# EasyEDA Pro project Charger Splitter.eprj, board PCB3
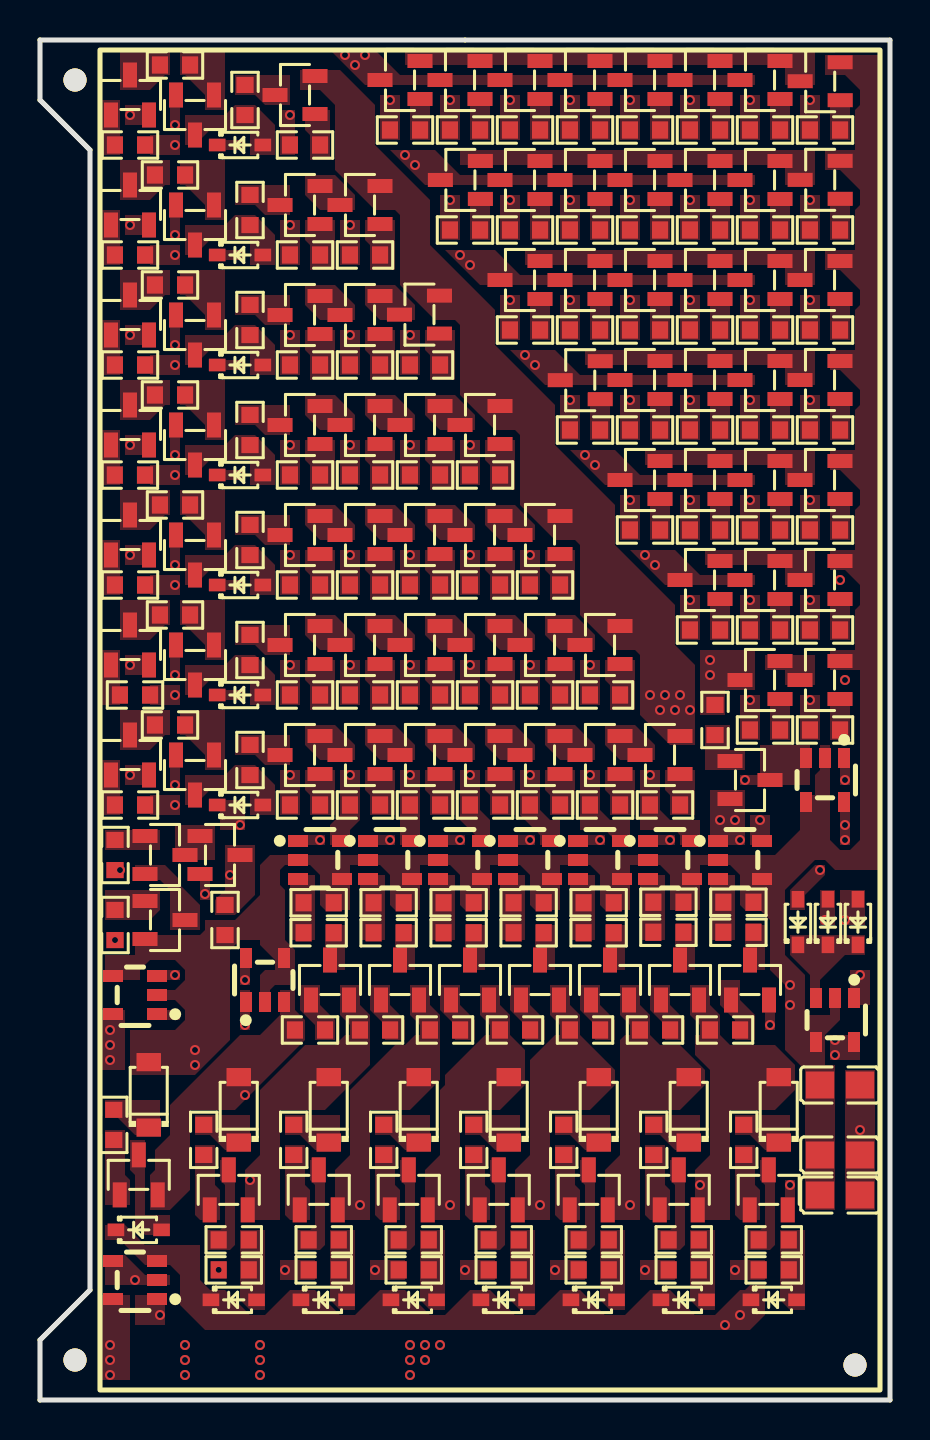
[diagram p9: board, top side]
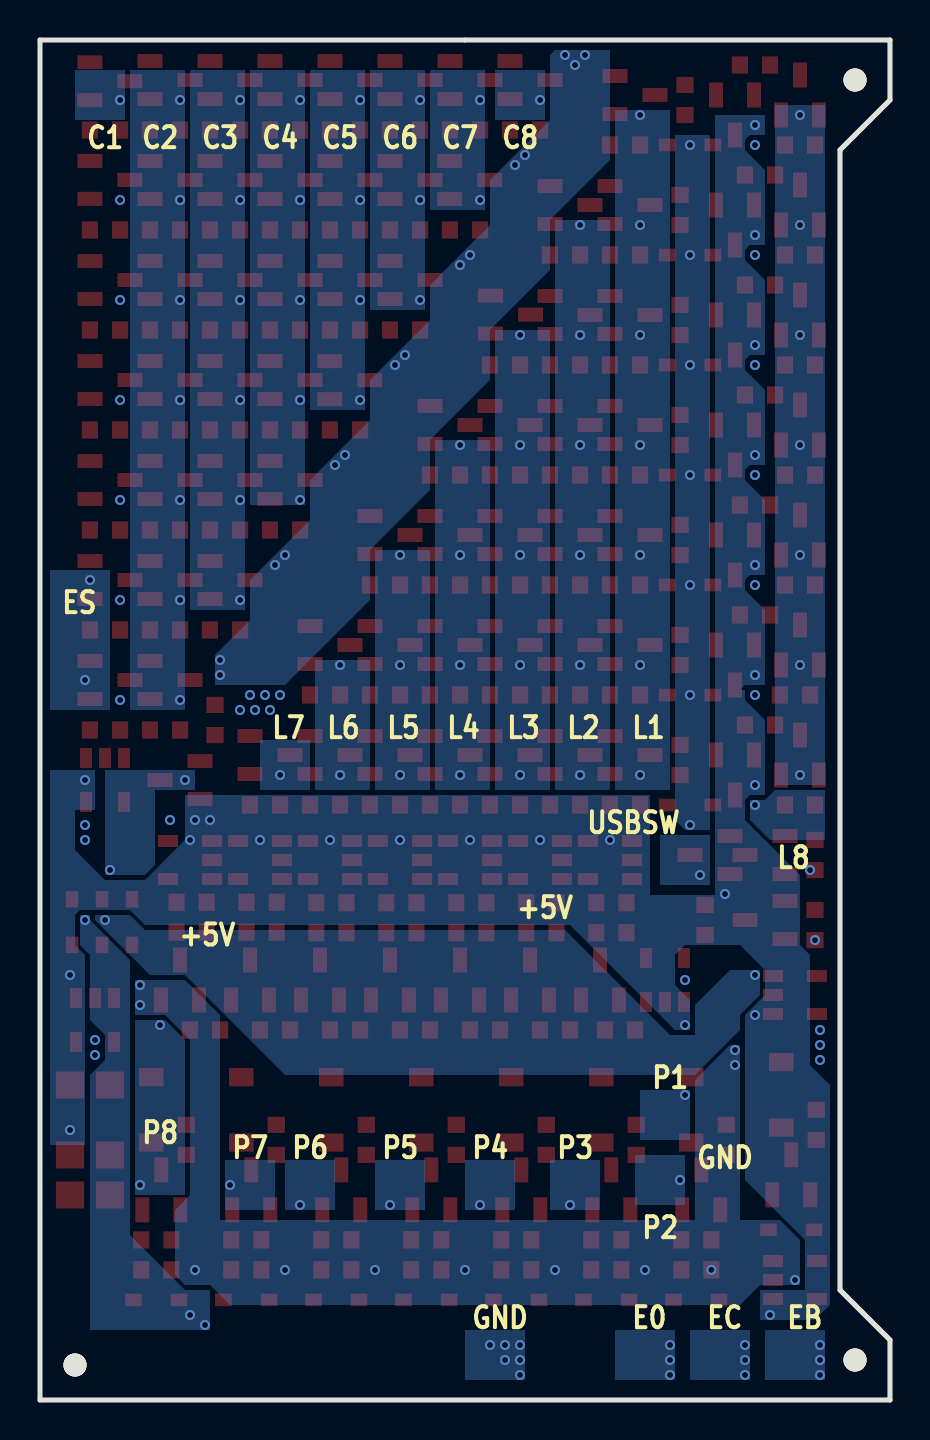
[diagram p10: board, bottom side, seen from below]

Outline 42.5 x 68 mm; copper layers: Top Layer, Inner1, Inner2, Bottom Layer. Coordinates in mm from the lower left corner of the outline.
Outline path: 0,68 42.5,68 42.5,0 0,0 0,3 2.5,5.5 2.5,62.5 0,65 0,68
Stack: Top Layer 0.035mm Outer layer thickness 1oz / Dielectric1 0.2104mm 7628 RC49% 8.6mil / Inner1 0.0152mm Inner layer thickness / Dielectric2 1.065mm 1.1mm H/HOZ Copper / Inner2 0.0152mm Inner layer thickness / Dielectric3 0.2104mm 7628 RC49% 8.6mil / Bottom Layer 0.035mm Outer layer thickness 1oz

## Design rules (mm)
template: JLCPCB Capability(Two Layers Board)
spacing copperThickness1oz (default): track to track 0.102, other pairs 0.152 to 0.3
spacing copperThickness2oz: track to track 0.203, other pairs 0.152 to 0.3
track width copperThickness1oz (default): min 0.127, default 0.254, max 2.54
track width copperThickness2oz: min 0.203, default 0.254, max 2.54
differential pair differentialPair (default): width min 0.127, default 0.254, max 2.54; gap min 0.152, default 0.152
via viaSize (default): diameter min 0.5, default 0.61, max 10; hole min 0.3, default 0.305, max 6.3

## Placement (name value [footprint] x y rotation side)
C1  47uF  [C0805]  40 12.25 180 top
C2  47uF  [C0805]  40 15.75 180 top
C3  47uF  [C0805]  40 10.25 180 top
D22  MM1Z3V3  [SOD-123_L2.7-W1.6-LS3.7-RD]  5.44 15.26 90 top
D23  SD103AWS  [SOD-323_L1.7-W1.3-LS2.6-RD-1]  4.94 8.51 0 top
D24  SD103AWS  [SOD-323_L1.7-W1.3-LS2.6-RD-1]  10 51.75 0 top
D25  SD103AWS  [SOD-323_L1.7-W1.3-LS2.6-RD-1]  10 46.25 0 top
D26  SD103AWS  [SOD-323_L1.7-W1.3-LS2.6-RD-1]  10 57.25 0 top
D27  SD103AWS  [SOD-323_L1.7-W1.3-LS2.6-RD-1]  10 40.75 0 top
D28  SD103AWS  [SOD-323_L1.7-W1.3-LS2.6-RD-1]  10 62.75 0 top
D29  SD103AWS  [SOD-323_L1.7-W1.3-LS2.6-RD-1]  10 35.25 0 top
D30  SD103AWS  [SOD-323_L1.7-W1.3-LS2.6-RD-1]  10 29.75 0 top
D36  MM1Z3V3  [SOD-123_L2.7-W1.6-LS3.7-RD]  9.94 14.51 90 top
D37  SD103AWS  [SOD-323_L1.7-W1.3-LS2.6-RD-1]  9.69 5.01 0 top
D38  MM1Z3V3  [SOD-123_L2.7-W1.6-LS3.7-RD]  14.44 14.51 90 top
D39  SD103AWS  [SOD-323_L1.7-W1.3-LS2.6-RD-1]  14.19 5.01 0 top
D40  MM1Z3V3  [SOD-123_L2.7-W1.6-LS3.7-RD]  18.94 14.51 90 top
D41  SD103AWS  [SOD-323_L1.7-W1.3-LS2.6-RD-1]  18.69 5.01 0 top
D42  MM1Z3V3  [SOD-123_L2.7-W1.6-LS3.7-RD]  23.44 14.51 90 top
D43  SD103AWS  [SOD-323_L1.7-W1.3-LS2.6-RD-1]  23.19 5.01 0 top
D44  MM1Z3V3  [SOD-123_L2.7-W1.6-LS3.7-RD]  27.94 14.51 90 top
D45  SD103AWS  [SOD-323_L1.7-W1.3-LS2.6-RD-1]  27.69 5.01 0 top
D46  MM1Z3V3  [SOD-123_L2.7-W1.6-LS3.7-RD]  32.44 14.51 90 top
D47  SD103AWS  [SOD-323_L1.7-W1.3-LS2.6-RD-1]  32.19 5.01 0 top
D48  MM1Z3V3  [SOD-123_L2.7-W1.6-LS3.7-RD]  36.94 14.51 90 top
D49  SD103AWS  [SOD-323_L1.7-W1.3-LS2.6-RD-1]  36.69 5.01 0 top
D50  SD103AWS  [SOD-323_L1.7-W1.3-LS2.6-RD-1]  37.9 23.9 90 top
D51  SD103AWS  [SOD-323_L1.7-W1.3-LS2.6-RD-1]  39.4 23.9 90 top
D52  SD103AWS  [SOD-323_L1.7-W1.3-LS2.6-RD-1]  40.9 23.9 90 top
NOREF  -  [Pad_e593]  1.75 66 0 top
NOREF#2  -  [Pad_e108]  40.75 1.75 0 top
NOREF#3  -  [Pad_e469]  1.75 2 0 top
Q164  MMBT4401  [SOT-23-3_L2.9-W1.3-P1.90-LS2.4-BR]  36 36 0 top
Q165  MMBT4401  [SOT-23-3_L2.9-W1.3-P1.90-LS2.4-BR]  39 36 0 top
Q166  MMBT4401  [SOT-23-3_L2.9-W1.3-P1.90-LS2.4-BR]  39 41 0 top
Q167  MMBT4401  [SOT-23-3_L2.9-W1.3-P1.90-LS2.4-BR]  33 41 0 top
Q168  MMBT4401  [SOT-23-3_L2.9-W1.3-P1.90-LS2.4-BR]  36 41 0 top
Q169  MMBT4401  [SOT-23-3_L2.9-W1.3-P1.90-LS2.4-BR]  36 46 0 top
Q170  MMBT4401  [SOT-23-3_L2.9-W1.3-P1.90-LS2.4-BR]  33 46 0 top
Q171  MMBT4401  [SOT-23-3_L2.9-W1.3-P1.90-LS2.4-BR]  30 46 0 top
Q172  MMBT4401  [SOT-23-3_L2.9-W1.3-P1.90-LS2.4-BR]  39 46 0 top
Q173  MMBT4401  [SOT-23-3_L2.9-W1.3-P1.90-LS2.4-BR]  39 51 0 top
Q174  MMBT4401  [SOT-23-3_L2.9-W1.3-P1.90-LS2.4-BR]  27.01 50.99 0 top
Q175  MMBT4401  [SOT-23-3_L2.9-W1.3-P1.90-LS2.4-BR]  30 51 0 top
Q176  MMBT4401  [SOT-23-3_L2.9-W1.3-P1.90-LS2.4-BR]  33 51 0 top
Q177  MMBT4401  [SOT-23-3_L2.9-W1.3-P1.90-LS2.4-BR]  36 51 0 top
Q178  MMBT4401  [SOT-23-3_L2.9-W1.3-P1.90-LS2.4-BR]  39 56 0 top
Q179  MMBT4401  [SOT-23-3_L2.9-W1.3-P1.90-LS2.4-BR]  24 56 0 top
Q180  MMBT4401  [SOT-23-3_L2.9-W1.3-P1.90-LS2.4-BR]  27 56 0 top
Q181  MMBT4401  [SOT-23-3_L2.9-W1.3-P1.90-LS2.4-BR]  30 56 0 top
Q182  MMBT4401  [SOT-23-3_L2.9-W1.3-P1.90-LS2.4-BR]  33 56 0 top
Q183  MMBT4401  [SOT-23-3_L2.9-W1.3-P1.90-LS2.4-BR]  36 56 0 top
Q184  MMBT4401  [SOT-23-3_L2.9-W1.3-P1.90-LS2.4-BR]  39.01 61.01 0 top
Q185  MMBT4401  [SOT-23-3_L2.9-W1.3-P1.90-LS2.4-BR]  36 61 0 top
Q186  MMBT4401  [SOT-23-3_L2.9-W1.3-P1.90-LS2.4-BR]  33 61 0 top
Q187  MMBT4401  [SOT-23-3_L2.9-W1.3-P1.90-LS2.4-BR]  30 61 0 top
Q188  MMBT4401  [SOT-23-3_L2.9-W1.3-P1.90-LS2.4-BR]  27 61 0 top
Q189  MMBT4401  [SOT-23-3_L2.9-W1.3-P1.90-LS2.4-BR]  24 61 0 top
Q190  MMBT4401  [SOT-23-3_L2.9-W1.3-P1.90-LS2.4-BR]  21.02 61 0 top
Q191  MMBT4401  [SOT-23-3_L2.9-W1.3-P1.90-LS2.4-BR]  39.01 65.94 0 top
Q192  MMBT4401  [SOT-23-3_L2.9-W1.3-P1.90-LS2.4-BR]  18 66 0 top
Q193  MMBT4401  [SOT-23-3_L2.9-W1.3-P1.90-LS2.4-BR]  21 66 0 top
Q194  MMBT4401  [SOT-23-3_L2.9-W1.3-P1.90-LS2.4-BR]  24 66 0 top
Q195  MMBT4401  [SOT-23-3_L2.9-W1.3-P1.90-LS2.4-BR]  27 66 0 top
Q196  MMBT4401  [SOT-23-3_L2.9-W1.3-P1.90-LS2.4-BR]  30 66 0 top
Q197  MMBT4401  [SOT-23-3_L2.9-W1.3-P1.90-LS2.4-BR]  33 66 0 top
Q198  MMBT4401  [SOT-23-3_L2.9-W1.3-P1.90-LS2.4-BR]  36 66 0 top
Q199  MMBT4401  [SOT-23-3_L2.9-W1.3-P1.90-LS2.4-BR]  6.25 27.25 180 top
Q200  MMBT4401  [SOT-23-3_L2.9-W1.3-P1.90-LS2.4-BR]  6.25 24 180 top
Q201  MMBT4401  [SOT-23-3_L2.9-W1.3-P1.90-LS2.4-BR]  22 48.75 0 top
Q202  MMBT4401  [SOT-23-3_L2.9-W1.3-P1.90-LS2.4-BR]  19 48.75 0 top
Q203  MMBT4401  [SOT-23-3_L2.9-W1.3-P1.90-LS2.4-BR]  16 48.75 0 top
Q204  MMBT4401  [SOT-23-3_L2.9-W1.3-P1.90-LS2.4-BR]  13 48.75 0 top
Q205  MMBT4401  [SOT-23-3_L2.9-W1.3-P1.90-LS2.4-BR]  4.5 48.75 270 top
Q206  MMBT4401  [SOT-23-3_L2.9-W1.3-P1.90-LS2.4-BR]  25 43.25 0 top
Q207  MMBT4401  [SOT-23-3_L2.9-W1.3-P1.90-LS2.4-BR]  22 43.25 0 top
Q208  MMBT4401  [SOT-23-3_L2.9-W1.3-P1.90-LS2.4-BR]  19 43.25 0 top
Q209  MMBT4401  [SOT-23-3_L2.9-W1.3-P1.90-LS2.4-BR]  16 43.25 0 top
Q210  MMBT4401  [SOT-23-3_L2.9-W1.3-P1.90-LS2.4-BR]  13 43.25 0 top
Q211  MMBT4401  [SOT-23-3_L2.9-W1.3-P1.90-LS2.4-BR]  4.5 43.25 270 top
Q212  MMBT4401  [SOT-23-3_L2.9-W1.3-P1.90-LS2.4-BR]  16 37.75 0 top
Q213  MMBT4401  [SOT-23-3_L2.9-W1.3-P1.90-LS2.4-BR]  13 37.75 0 top
Q214  MMBT4401  [SOT-23-3_L2.9-W1.3-P1.90-LS2.4-BR]  19 37.75 0 top
Q215  MMBT4401  [SOT-23-3_L2.9-W1.3-P1.90-LS2.4-BR]  22 37.75 0 top
Q216  MMBT4401  [SOT-23-3_L2.9-W1.3-P1.90-LS2.4-BR]  25 37.75 0 top
Q217  MMBT4401  [SOT-23-3_L2.9-W1.3-P1.90-LS2.4-BR]  4.5 37.75 270 top
Q218  MMBT4401  [SOT-23-3_L2.9-W1.3-P1.90-LS2.4-BR]  28 37.75 0 top
Q219  MMBT4401  [SOT-23-3_L2.9-W1.3-P1.90-LS2.4-BR]  18.97 54.27 0 top
Q220  MMBT4401  [SOT-23-3_L2.9-W1.3-P1.90-LS2.4-BR]  16 54.25 0 top
Q221  MMBT4401  [SOT-23-3_L2.9-W1.3-P1.90-LS2.4-BR]  13 54.25 0 top
Q222  MMBT4401  [SOT-23-3_L2.9-W1.3-P1.90-LS2.4-BR]  4.5 54.25 270 top
Q223  MMBT4401  [SOT-23-3_L2.9-W1.3-P1.90-LS2.4-BR]  13 59.75 0 top
Q224  MMBT4401  [SOT-23-3_L2.9-W1.3-P1.90-LS2.4-BR]  16 59.75 0 top
Q225  MMBT4401  [SOT-23-3_L2.9-W1.3-P1.90-LS2.4-BR]  4.5 59.75 270 top
Q226  MMBT4401  [SOT-23-3_L2.9-W1.3-P1.90-LS2.4-BR]  4.5 65.25 270 top
Q227  MMBT4401  [SOT-23-3_L2.9-W1.3-P1.90-LS2.4-BR]  12.75 65.25 0 top
Q228  MMBT4401  [SOT-23-3_L2.9-W1.3-P1.90-LS2.4-BR]  4.5 32.25 270 top
Q229  MMBT4401  [SOT-23-3_L2.9-W1.3-P1.90-LS2.4-BR]  13 32.25 0 top
Q230  MMBT4401  [SOT-23-3_L2.9-W1.3-P1.90-LS2.4-BR]  16 32.25 0 top
Q231  MMBT4401  [SOT-23-3_L2.9-W1.3-P1.90-LS2.4-BR]  19 32.25 0 top
Q232  MMBT4401  [SOT-23-3_L2.9-W1.3-P1.90-LS2.4-BR]  22 32.25 0 top
Q233  MMBT4401  [SOT-23-3_L2.9-W1.3-P1.90-LS2.4-BR]  25 32.25 0 top
Q234  MMBT4401  [SOT-23-3_L2.9-W1.3-P1.90-LS2.4-BR]  28 32.25 0 top
Q235  MMBT4401  [SOT-23-3_L2.9-W1.3-P1.90-LS2.4-BR]  31 32.25 0 top
Q237  MMBT4403  [SOT-23-3_L2.9-W1.3-P0.95-LS2.4-BR]  7.75 53.25 90 top
Q238  MMBT4403  [SOT-23-3_L2.9-W1.3-P0.95-LS2.4-BR]  7.75 58.75 90 top
Q239  MMBT4403  [SOT-23-3_L2.9-W1.3-P0.95-LS2.4-BR]  7.75 64.25 90 top
Q240  MMBT4403  [SOT-23-3_L2.9-W1.3-P0.95-LS2.4-BR]  7.75 36.75 90 top
Q241  MMBT4403  [SOT-23-3_L2.9-W1.3-P0.95-LS2.4-BR]  7.75 42.25 90 top
Q242  MMBT4403  [SOT-23-3_L2.9-W1.3-P0.95-LS2.4-BR]  7.75 47.75 90 top
Q243  MMBT4403  [SOT-23-3_L2.9-W1.3-P0.95-LS2.4-BR]  7.75 31.25 90 top
Q244  MMBT4403  [SOT-23-3_L2.9-W1.3-P0.95-LS2.4-BR]  4.94 11.26 270 top
Q245  MMBT4403  [SOT-23-3_L2.9-W1.3-P0.95-LS2.4-BR]  9.44 10.51 270 top
Q246  MMBT4403  [SOT-23-3_L2.9-W1.3-P0.95-LS2.4-BR]  13.94 10.51 270 top
Q247  MMBT4403  [SOT-23-3_L2.9-W1.3-P0.95-LS2.4-BR]  18.44 10.51 270 top
Q248  MMBT4403  [SOT-23-3_L2.9-W1.3-P0.95-LS2.4-BR]  22.94 10.51 270 top
Q249  MMBT4403  [SOT-23-3_L2.9-W1.3-P0.95-LS2.4-BR]  27.44 10.51 270 top
Q250  MMBT4403  [SOT-23-3_L2.9-W1.3-P0.95-LS2.4-BR]  31.94 10.51 270 top
Q251  MMBT4403  [SOT-23-3_L2.9-W1.3-P0.95-LS2.4-BR]  36.44 10.51 270 top
Q252  MMBT4403  [SOT-23-3_L2.9-W1.3-P0.95-LS2.4-BR]  14.5 21 270 top
Q253  MMBT4403  [SOT-23-3_L2.9-W1.3-P0.95-LS2.4-BR]  18 21 270 top
Q254  MMBT4403  [SOT-23-3_L2.9-W1.3-P0.95-LS2.4-BR]  21.5 21 270 top
Q255  MMBT4403  [SOT-23-3_L2.9-W1.3-P0.95-LS2.4-BR]  25 21 270 top
Q256  MMBT4403  [SOT-23-3_L2.9-W1.3-P0.95-LS2.4-BR]  28.5 21 270 top
Q257  MMBT4403  [SOT-23-3_L2.9-W1.3-P0.95-LS2.4-BR]  32 21 270 top
Q258  MMBT4403  [SOT-23-3_L2.9-W1.3-P0.95-LS2.4-BR]  35.5 21 270 top
Q259  MMBT4403  [SOT-23-3_L2.9-W1.3-P0.95-LS2.4-BR]  35.5 31 180 top
Q260  MMBT4403  [SOT-23-3_L2.9-W1.3-P0.95-LS2.4-BR]  9 27.25 180 top
R81  22kΩ  [R0603]  4.5 62.75 0 top
R82  22kΩ  [R0603]  6.75 66.75 0 top
R83  22kΩ  [R0603]  10.25 65 270 top
R87  22kΩ  [R0603]  13.25 62.75 180 top
R88  22kΩ  [R0603]  4.5 57.25 0 top
R89  22kΩ  [R0603]  6.5 61.25 0 top
R90  22kΩ  [R0603]  10.5 59.5 270 top
R91  22kΩ  [R0603]  13.25 57.25 180 top
R92  22kΩ  [R0603]  16.25 57.25 180 top
R93  22kΩ  [R0603]  4.5 51.75 0 top
R94  22kΩ  [R0603]  6.5 55.75 0 top
R95  22kΩ  [R0603]  10.5 54 270 top
R96  22kΩ  [R0603]  13.25 51.75 180 top
R97  22kΩ  [R0603]  16.25 51.75 180 top
R98  22kΩ  [R0603]  19.25 51.75 180 top
R99  22kΩ  [R0603]  4.5 46.25 0 top
R100  22kΩ  [R0603]  6.5 50.25 0 top
R101  22kΩ  [R0603]  10.5 48.5 270 top
R102  22kΩ  [R0603]  13.25 46.25 180 top
R103  22kΩ  [R0603]  16.25 46.25 180 top
R104  22kΩ  [R0603]  19.25 46.25 180 top
R105  22kΩ  [R0603]  22.25 46.25 180 top
R106  22kΩ  [R0603]  4.5 40.75 0 top
R107  22kΩ  [R0603]  6.75 44.75 0 top
R108  22kΩ  [R0603]  10.5 43 270 top
R109  22kΩ  [R0603]  13.25 40.75 180 top
R110  22kΩ  [R0603]  16.25 40.75 180 top
R111  22kΩ  [R0603]  19.25 40.75 180 top
R112  22kΩ  [R0603]  22.25 40.75 180 top
R113  22kΩ  [R0603]  25.25 40.75 180 top
R114  22kΩ  [R0603]  4.75 35.25 0 top
R115  22kΩ  [R0603]  6.75 39.25 0 top
R116  22kΩ  [R0603]  10.5 37.5 270 top
R117  22kΩ  [R0603]  13.25 35.25 180 top
R118  22kΩ  [R0603]  16.25 35.25 180 top
R119  22kΩ  [R0603]  19.25 35.25 180 top
R120  22kΩ  [R0603]  22.25 35.25 180 top
R121  22kΩ  [R0603]  25.25 35.25 180 top
R122  22kΩ  [R0603]  28.25 35.25 180 top
R123  22kΩ  [R0603]  4.5 29.75 0 top
R124  22kΩ  [R0603]  6.5 33.75 0 top
R125  22kΩ  [R0603]  10.5 32 270 top
R126  22kΩ  [R0603]  13.25 29.75 180 top
R127  22kΩ  [R0603]  16.25 29.75 180 top
R128  22kΩ  [R0603]  19.25 29.75 180 top
R129  22kΩ  [R0603]  22.25 29.75 180 top
R130  22kΩ  [R0603]  25.25 29.75 180 top
R131  22kΩ  [R0603]  28.25 29.75 180 top
R132  22kΩ  [R0603]  31.25 29.75 180 top
R171  3kΩ  [R0603]  13.93 24.86 0 top
R172  3kΩ  [R0603]  13.93 23.36 180 top
R174  3kΩ  [R0603]  17.43 24.86 0 top
R175  6.2kΩ  [R0603]  17.43 23.36 180 top
R177  3kΩ  [R0603]  20.93 24.86 0 top
R178  9.1kΩ  [R0603]  20.93 23.36 180 top
R180  3kΩ  [R0603]  24.43 24.86 0 top
R181  12kΩ  [R0603]  24.43 23.36 180 top
R183  3kΩ  [R0603]  27.93 24.86 0 top
R184  15kΩ  [R0603]  27.93 23.36 180 top
R186  3kΩ  [R0603]  31.42 24.89 0 top
R187  18kΩ  [R0603]  31.42 23.39 180 top
R189  3kΩ  [R0603]  34.92 24.89 0 top
R190  22kΩ  [R0603]  34.92 23.39 180 top
R193  3kΩ  [R0603]  9.69 6.51 180 top
R194  3kΩ  [R0603]  9.69 8.01 0 top
R196  3kΩ  [R0603]  14.19 6.51 180 top
R199  3kΩ  [R0603]  18.69 6.51 180 top
R202  3kΩ  [R0603]  23.19 6.51 180 top
R205  3kΩ  [R0603]  27.69 6.51 180 top
R208  3kΩ  [R0603]  32.19 6.51 180 top
R211  3kΩ  [R0603]  36.69 6.51 180 top
R212  6.2kΩ  [R0603]  14.19 8.01 0 top
R213  9.1kΩ  [R0603]  18.69 8.01 0 top
R214  12kΩ  [R0603]  23.19 8.01 0 top
R215  15kΩ  [R0603]  27.69 8.01 0 top
R216  18kΩ  [R0603]  32.19 8.01 0 top
R217  22kΩ  [R0603]  36.69 8.01 0 top
R219  22kΩ  [R0603]  3.75 27.25 90 top
R222  22kΩ  [R0603]  3.75 23.75 90 top
R223  22kΩ  [R0603]  9.25 24 270 top
R224  12kΩ  [R0603]  18.25 63.5 180 top
R225  12kΩ  [R0603]  21.25 63.5 180 top
R226  12kΩ  [R0603]  24.25 63.5 180 top
R227  12kΩ  [R0603]  27.25 63.5 180 top
R228  12kΩ  [R0603]  30.25 63.5 180 top
R229  12kΩ  [R0603]  33.25 63.5 180 top
R230  12kΩ  [R0603]  36.25 63.5 180 top
R231  12kΩ  [R0603]  21.25 58.5 180 top
R232  12kΩ  [R0603]  24.25 58.5 0 top
R233  12kΩ  [R0603]  27.25 58.5 180 top
R234  12kΩ  [R0603]  33.25 58.5 180 top
R235  12kΩ  [R0603]  30.25 58.5 180 top
R236  12kΩ  [R0603]  36.25 58.5 180 top
R237  12kΩ  [R0603]  39.25 58.5 0 top
R238  12kΩ  [R0603]  39.25 63.5 0 top
R239  12kΩ  [R0603]  24.25 53.5 180 top
R240  12kΩ  [R0603]  27.25 53.5 180 top
R241  12kΩ  [R0603]  30.25 53.5 180 top
R242  12kΩ  [R0603]  33.25 53.5 180 top
R243  12kΩ  [R0603]  36.25 53.5 180 top
R244  12kΩ  [R0603]  39.25 53.5 0 top
R245  12kΩ  [R0603]  36.25 48.5 180 top
R246  12kΩ  [R0603]  33.25 48.5 180 top
R247  12kΩ  [R0603]  30.25 48.5 180 top
R248  12kΩ  [R0603]  27.25 48.5 180 top
R249  12kΩ  [R0603]  39.25 48.5 0 top
R250  12kΩ  [R0603]  30.25 43.5 180 top
R251  12kΩ  [R0603]  33.25 43.5 180 top
R252  12kΩ  [R0603]  36.25 43.5 180 top
R253  12kΩ  [R0603]  39.25 43.5 0 top
R254  12kΩ  [R0603]  36.25 38.5 180 top
R255  12kΩ  [R0603]  33.25 38.5 180 top
R256  12kΩ  [R0603]  39.25 38.5 0 top
R257  12kΩ  [R0603]  36.25 33.5 180 top
R258  12kΩ  [R0603]  39.25 33.5 0 top
R259  12kΩ  [R0603]  33.75 34 90 top
R260  9.1kΩ  [R0603]  34.25 18.5 0 top
R261  9.1kΩ  [R0603]  30.75 18.5 0 top
R262  9.1kΩ  [R0603]  27.25 18.5 0 top
R263  9.1kΩ  [R0603]  23.75 18.5 0 top
R264  9.1kΩ  [R0603]  20.25 18.5 0 top
R266  9.1kΩ  [R0603]  13.5 18.5 0 top
R267  3kΩ  [R0603]  3.69 13.76 90 top
R268  3kΩ  [R0603]  8.19 13.01 90 top
R269  3kΩ  [R0603]  12.69 13.01 90 top
R270  3kΩ  [R0603]  17.19 13.01 90 top
R271  3kΩ  [R0603]  21.69 13.01 90 top
R272  3kΩ  [R0603]  26.19 13.01 90 top
R273  3kΩ  [R0603]  30.69 13.01 90 top
R274  3kΩ  [R0603]  35.19 13.01 90 top
R275  9.1kΩ  [R0603]  16.75 18.5 0 top
U12  EG27517  [SOT-23-5_L2.9-W1.6-P0.95-LS2.8-BR]  4.75 20.25 0 top
U13  EG27517  [SOT-23-5_L2.9-W1.6-P0.95-LS2.8-BR]  39.25 31 90 top
U14  EG27517  [SOT-23-5_L2.9-W1.6-P0.95-LS2.8-BR]  11.25 21 270 top
U15  EG27517  [SOT-23-5_L2.9-W1.6-P0.95-LS2.8-BR]  14 27 180 top
U16  EG27517  [SOT-23-5_L2.9-W1.6-P0.95-LS2.8-BR]  17.5 27 180 top
U17  EG27517  [SOT-23-5_L2.9-W1.6-P0.95-LS2.8-BR]  21 27 180 top
U18  EG27517  [SOT-23-5_L2.9-W1.6-P0.95-LS2.8-BR]  24.5 27 180 top
U19  EG27517  [SOT-23-5_L2.9-W1.6-P0.95-LS2.8-BR]  28 27 180 top
U20  EG27517  [SOT-23-5_L2.9-W1.6-P0.95-LS2.8-BR]  31.5 27 180 top
U21  EG27517  [SOT-23-5_L2.9-W1.6-P0.95-LS2.8-BR]  35 27 180 top
U22  EG27517  [SOT-23-5_L2.9-W1.6-P0.95-LS2.8-BR]  4.75 6 0 top
U24  EG27517  [SOT-23-5_L2.9-W1.6-P0.95-LS2.8-BR]  39.75 19 90 top

## Footprints (pads in the part's own frame, mm; a bottom-side part is the same pattern mirrored in y, then rotated)
C0805
  rect 1.41x1.35 smd: 1(-1,0) 2(1,0)
Pad_e108
  round 1.152 hole 1.152: 1(0,0)
Pad_e469
  round 1.152 hole 1.152: 1(0,0)
Pad_e593
  round 1.152 hole 1.152: 1(0,0)
R0603
  rect 0.806x0.864 smd: 1(-0.753,0) 2(0.753,0)
SOD-123_L2.7-W1.6-LS3.7-RD
  rect 0.91x1.22 smd: 1(-1.635,0) 2(1.635,0)
SOD-323_L1.7-W1.3-LS2.6-RD-1
  rect 0.83x0.63 smd: 1(-1.14,0) 2(1.14,0)
SOT-23-3_L2.9-W1.3-P0.95-LS2.4-BR
  rect 1.25x0.7 smd: 1(1,-0.95) 2(1,0.95) 3(-1,0)
SOT-23-3_L2.9-W1.3-P1.90-LS2.4-BR
  rect 1.25x0.7 smd: 1(1,-0.95) 2(1,0.95) 3(-1,0)
SOT-23-5_L2.9-W1.6-P0.95-LS2.8-BR
  rect 1x0.6 smd: 1(1.1,-0.95) 2(1.1,0) 3(1.1,0.95) 4(-1.1,0.95) 5(-1.1,-0.95)

## Nets
As in the schematic.

Pads without a net: NOREF 1; NOREF#2 1; NOREF#3 1

## Via types
v1: diameter 0.5, hole 0.3, Top Layer to Bottom Layer, 185 vias

## Routing (per net, layer and track width the routed paths; a pad name or vN(x,y) marks a point on that pad's centre or on a via; arc(x,y) is an arc through that point)
+5V:
  vias: v1(6,4.25) v1(6.75,63.75) v1(6.75,58.25) v1(6.75,52.75) v1(6.75,47.25) v1(6.75,41.75) v1(6.75,36.25) v1(6.75,30.75) v1(6.75,19.25) v1(8.25,25.3) v1(10.25,18.75) v1(14,28) v1(17.5,28) v1(21,28) v1(24.5,28) v1(28,28) v1(31.5,28) v1(34,29) v1(34.75,29) v1(35,28) v1(40.25,31) v1(41,21.25) v1(41,13.5)
GND:
  vias: v1(4.5,64.25) v1(4.5,58.75) v1(4.5,53.25) v1(4.5,47.75) v1(4.5,42.25) v1(4.5,36.75) v1(4.5,31.25) v1(4.75,6) v1(7.75,17.5) v1(7.75,16.75) v1(8.93,6.51) v1(12.25,6.5) v1(16.75,6.5) v1(18.5,2.75) v1(18.5,2) v1(18.5,1.25) v1(19.25,2.75) v1(19.25,2) v1(20,2.75) v1(21.25,6.5) v1(25.75,6.5) v1(30.25,6.5) v1(30.5,35.25) v1(31,34.5) v1(31.25,35.25) v1(31.75,34.5) v1(32,35.25) v1(32.5,34.5) v1(34.75,6.5) v1(37.5,20.75) v1(37.5,19.75)
C1:
  vias: v1(38.5,65)
C2:
  vias: v1(17.5,65) v1(38.5,60)
C3:
  vias: v1(20.5,65) v1(20.5,60) v1(38.5,55)
C4:
  vias: v1(23.5,65) v1(23.5,60) v1(23.5,55) v1(38.5,50)
C5:
  vias: v1(26.5,65) v1(26.5,60) v1(26.5,55) v1(26.5,50) v1(38.5,45)
C6:
  vias: v1(29.5,65) v1(29.5,60) v1(29.5,55) v1(29.5,50) v1(29.5,45) v1(38.5,40)
C7:
  vias: v1(32.5,65) v1(32.5,60) v1(32.5,55) v1(32.5,50) v1(32.5,45) v1(32.5,40) v1(38.5,35)
C8:
  vias: v1(35.5,65) v1(35.5,60) v1(35.5,55) v1(35.5,50) v1(35.5,45) v1(35.5,40) v1(35.5,35)
CELLERROR:
  vias: v1(3.5,18.5) v1(3.5,17.75) v1(3.5,17) v1(7.25,2.75) v1(7.25,2) v1(7.25,1.25)
CELLERRORSIG:
  vias: v1(6.75,21.25) v1(10,62.75) v1(10,57.25) v1(10,51.75) v1(10,46.25) v1(10,40.75) v1(10,35.25) v1(10,28.75) v1(39.25,24)
ERRORGEN:
  vias: v1(4,26.5) v1(11,2.75) v1(11,2) v1(11,1.25) v1(39.75,18) v1(39.75,17.25)
LEDMOS1:
  vias: v1(10.25,21) v1(12.5,64.25) v1(12.5,58.75) v1(12.5,53.25) v1(12.5,47.75) v1(12.5,42.25) v1(12.5,36.75) v1(12.5,31.25)
LEDMOS2:
  vias: v1(3.75,23) v1(6.75,62.75) v1(15.5,58.75) v1(15.5,53.25) v1(15.5,47.75) v1(15.5,42.25) v1(15.5,36.75) v1(15.5,31.25)
LEDMOS3:
  vias: v1(6.75,57.25) v1(18.5,53.25) v1(18.5,47.75) v1(18.5,42.25) v1(18.5,36.75) v1(18.5,31.25)
LEDMOS4:
  vias: v1(6.75,51.75) v1(21.5,47.75) v1(21.5,42.25) v1(21.5,36.75) v1(21.5,31.25)
LEDMOS5:
  vias: v1(6.75,46.25) v1(24.5,42.25) v1(24.5,36.75) v1(24.5,31.25)
LEDMOS6:
  vias: v1(6.75,40.75) v1(27.5,36.75) v1(27.5,31.25)
LEDMOS7:
  vias: v1(6.75,35.25) v1(30.5,31.25)
LEDMOS8:
  vias: v1(6.75,29.75) v1(36,29)
LOWBATTERROR:
  vias: v1(3.5,2.75) v1(3.5,2) v1(3.5,1.25)
LOWBATTSIG:
  vias: v1(34.25,3.75) v1(35,4.25) v1(40.25,24)
P1:
  vias: v1(10.25,15.25)
P2:
  vias: v1(10.5,11)
P3:
  vias: v1(16,9.75)
P4:
  vias: v1(20.5,9.75)
P5:
  vias: v1(25,9.75)
P6:
  vias: v1(29.5,9.75)
P7:
  vias: v1(33,10.75)
P8:
  vias: v1(36.5,18.75) v1(37.5,10.75)
SWERRORSIG:
  vias: v1(35.25,31) v1(39,26.5)
SWITCHERROR:
  vias: v1(40,41) v1(40.25,36) v1(40.25,28.75) v1(40.25,28)
USBPDSW:
  vias: v1(9.5,26.25)
$2N3494:
  vias: v1(15.25,67.25) v1(15.75,66.75) v1(16.25,67.25) v1(18.25,62.25) v1(18.75,61.75) v1(21,57.25) v1(21.5,56.75) v1(24.25,52.25) v1(24.75,51.75) v1(27.25,47.25) v1(27.75,46.75) v1(30.25,42.25) v1(30.75,41.75) v1(33.5,37) v1(33.5,36.25)

## Copper pours and planes (outline as drawn; the poured copper is in the pictures)
+5V on Top Layer: 33.5,30.5 35.25,30.5 35.25,27.75 33.5,27.75
+5V on Top Layer: 4.75,5.25 6.25,5.25 6.25,3.75 4.75,3.75
+5V on Top Layer: 6.5,38 7,38 7,36 6.5,36
+5V on Top Layer: 40.5,21.5 41.5,21.5 41.5,19.75 40.5,19.75
+5V on Top Layer: 40.25,16.5 41.75,16.5 41.75,9.5 40.25,9.5
+5V on Top Layer: 6.5,49 7,49 7,47 6.5,47
+5V on Top Layer: 6.5,65.5 7,65.5 7,63.5 6.5,63.5
+5V on Top Layer: 6.5,32.5 7,32.5 7,30.5 6.5,30.5
+5V on Top Layer: 10,20.5 10.5,20.5 10.5,18.5 10,18.5
+5V on Top Layer: 6.5,54.5 7,54.5 7,52.5 6.5,52.5
+5V on Top Layer: 6.5,43.5 7,43.5 7,41.5 6.5,41.5
+5V on Top Layer: 6.5,60 7,60 7,58 6.5,58
+5V on Bottom Layer: 3,64.25 42,64.25 42,4 3,4
+5V on Bottom Layer: 39.75,31.5 42,31.5 42,29.5 39.75,29.5
GND on Top Layer: 16.5,7 18.25,7 18.25,6 16.5,6
GND on Top Layer: 4.25,31.75 5.75,31.75 5.75,30.75 4.25,30.75
GND on Top Layer: 13,66.5 32.75,66.5 32.75,32.75 13,32.75
GND on Top Layer: 39.25,67.25 42,67.25 42,36.5 39.25,36.5
GND on Top Layer: 11,27.25 12.75,27.25 12.75,21.25 11,21.25
GND on Top Layer: 30,7 31.75,7 31.75,6 30,6
GND on Top Layer: 4.25,42.75 5.75,42.75 5.75,41.75 4.25,41.75
GND on Top Layer: 25.5,7 27.25,7 27.25,6 25.5,6
GND on Top Layer: 4.25,64.75 5.75,64.75 5.75,63.75 4.25,63.75
GND on Top Layer: 4.25,59.25 5.75,59.25 5.75,58.25 4.25,58.25
GND on Top Layer: 36,32.75 42,32.75 42,9.5 36,9.5
GND on Top Layer: 4.25,37.25 5.75,37.25 5.75,36.25 4.25,36.25
GND on Top Layer: 12.25,27.25 36.25,27.25 36.25,24.5 12.25,24.5
GND on Top Layer: 4.25,48.25 5.75,48.25 5.75,47.25 4.25,47.25
GND on Top Layer: 3.25,25.25 11.25,25.25 11.25,16.25 3.25,16.25
GND on Top Layer: 3.25,7.25 6.5,7.25 6.5,5.75 3.25,5.75
GND on Top Layer: 11,21.5 12.5,21.5 12.5,19.5 11,19.5
GND on Top Layer: 41,36.75 42,36.75 42,29 41,29
GND on Top Layer: 34.5,7 36.25,7 36.25,6 34.5,6
GND on Top Layer: 4.25,53.75 5.75,53.75 5.75,52.75 4.25,52.75
GND on Top Layer: 12,7 13.75,7 13.75,6 12,6
GND on Top Layer: 21,7 22.75,7 22.75,6 21,6
GND on Bottom Layer: 3.25,64.75 5.75,64.75 5.75,30.75 3.25,30.75
GND on Bottom Layer: 33.5,21 37.75,21 37.75,5.75 33.5,5.75
GND on Bottom Layer: 7.5,17.75 9.75,17.75 9.75,7.5 7.5,7.5
GND on Bottom Layer: 4.5,9 35.25,9 35.25,4.75 4.5,4.75
GND on Bottom Layer: 18.25,3.5 21.25,3.5 21.25,1 18.25,1
GND on Inner1: 3,67.5 42,67.5 42,1 3,1
GND on Inner2: 3,67.5 42,67.5 42,1 3,1
C1 on Top Layer: 38,65.25 39,65.25 39,63 38,63
C1 on Bottom Layer: 38.25,66.5 40.75,66.5 40.75,64 38.25,64
C2 on Top Layer: 17,65.25 18,65.25 18,63 17,63
C2 on Top Layer: 38,60.25 39,60.25 39,58 38,58
C2 on Bottom Layer: 17.25,66.5 19.75,66.5 19.75,64 17.25,64
C2 on Inner1: 17,65.25 39.25,65.25 39.25,59.25 17,59.25
C2 on Inner2: 17,65.25 39.25,65.25 39.25,59.25 17,59.25
C3 on Top Layer: 20,60.25 21,60.25 21,58 20,58
C3 on Top Layer: 38,55.25 39,55.25 39,53 38,53
C3 on Top Layer: 20,65.25 21,65.25 21,63 20,63
C3 on Bottom Layer: 20.25,66.5 23,66.5 23,59.5 20.25,59.5
C3 on Inner1: 20,60.25 39.25,60.25 39.25,54.25 20,54.25
C3 on Inner2: 20,60.25 39.25,60.25 39.25,54.25 20,54.25
C4 on Top Layer: 23,65.25 24,65.25 24,63 23,63
C4 on Top Layer: 23,60.25 24,60.25 24,58 23,58
C4 on Top Layer: 38,50.25 39,50.25 39,48 38,48
C4 on Top Layer: 23,55.25 24,55.25 24,53 23,53
C4 on Bottom Layer: 23.25,66.5 26,66.5 26,54.5 23.25,54.5
C4 on Inner1: 23,55.25 39.25,55.25 39.25,49.25 23,49.25
C4 on Inner2: 23,55.25 39.25,55.25 39.25,49.25 23,49.25
C5 on Top Layer: 26,60.25 27,60.25 27,58 26,58
C5 on Top Layer: 38,45.25 39,45.25 39,43 38,43
C5 on Top Layer: 26,50.25 27,50.25 27,48 26,48
C5 on Top Layer: 26,65.25 27,65.25 27,63 26,63
C5 on Top Layer: 26,55.25 27,55.25 27,53 26,53
C5 on Bottom Layer: 26.25,66.5 29,66.5 29,49.5 26.25,49.5
C5 on Inner1: 26,50.25 39.25,50.25 39.25,44.25 26,44.25
C5 on Inner2: 26,50.25 39.25,50.25 39.25,44.25 26,44.25
C6 on Top Layer: 29,50.25 30,50.25 30,48 29,48
C6 on Top Layer: 29,65.25 30,65.25 30,63 29,63
C6 on Top Layer: 29,45.25 30,45.25 30,43 29,43
C6 on Top Layer: 29,55.25 30,55.25 30,53 29,53
C6 on Top Layer: 29,60.25 30,60.25 30,58 29,58
C6 on Top Layer: 38,40.25 39,40.25 39,38 38,38
C6 on Bottom Layer: 29.25,66.5 32,66.5 32,44.75 29.25,44.75
C6 on Inner1: 29,45.25 39.25,45.25 39.25,39.25 29,39.25
C6 on Inner2: 29,45.25 39.25,45.25 39.25,39.25 29,39.25
C7 on Top Layer: 32,45.25 33,45.25 33,43 32,43
C7 on Top Layer: 32,60.25 33,60.25 33,58 32,58
C7 on Top Layer: 32,40.25 33,40.25 33,38 32,38
C7 on Top Layer: 32,65.25 33,65.25 33,63 32,63
C7 on Top Layer: 32,55.25 33,55.25 33,53 32,53
C7 on Top Layer: 38,35.25 39,35.25 39,33 38,33
C7 on Top Layer: 32,50.25 33,50.25 33,48 32,48
C7 on Bottom Layer: 32.25,66.5 35,66.5 35,39.5 32.25,39.5
C7 on Inner1: 32,40.25 39.25,40.25 39.25,34.75 32,34.75
C7 on Inner2: 32,40.25 39.25,40.25 39.25,34.75 32,34.75
C8 on Top Layer: 35,60.25 36,60.25 36,58 35,58
C8 on Top Layer: 35,50.25 36,50.25 36,48 35,48
C8 on Top Layer: 35,45.25 36,45.25 36,43 35,43
C8 on Top Layer: 35,40.25 36,40.25 36,38 35,38
C8 on Top Layer: 35,35.25 36,35.25 36,33 35,33
C8 on Top Layer: 35,55.25 36,55.25 36,53 35,53
C8 on Top Layer: 35,65.25 36,65.25 36,63 35,63
C8 on Bottom Layer: 35.25,66.5 38,66.5 38,34.5 35.25,34.5
CELLERROR on Top Layer: 3,19.5 4.25,19.5 4.25,16.5 3,16.5
CELLERROR on Bottom Layer: 7,3.5 10,3.5 10,1 7,1
CELLERROR on Inner1: 3,19 7.5,19 7.5,1 3,1
CELLERROR on Inner2: 3,19 7.5,19 7.5,1 3,1
CELLERRORSIG on Top Layer: 39,25.5 39.75,25.5 39.75,23.75 39,23.75
CELLERRORSIG on Top Layer: 9,30 10.25,30 10.25,28.5 9,28.5
CELLERRORSIG on Bottom Layer: 9,63.25 10.75,63.25 10.75,28.5 9,28.5
CELLERRORSIG on Bottom Layer: 6.5,24.25 39.75,24.25 39.75,16.25 6.5,16.25
CELLERRORSIG on Inner1: 6.25,29 10.25,29 10.25,21 6.25,21
CELLERRORSIG on Inner2: 6.25,29 10.25,29 10.25,21 6.25,21
ERRORGEN on Top Layer: 39.5,18.25 41,18.25 41,17 39.5,17
ERRORGEN on Bottom Layer: 10.75,3.5 13.75,3.5 13.75,1 10.75,1
ERRORGEN on Inner1: 4.75,19.25 14.75,19.25 14.75,1 4.75,1
ERRORGEN on Inner1: 3.75,27 40,27 40,17 3.75,17
ERRORGEN on Inner2: 4.75,19.25 14.75,19.25 14.75,1 4.75,1
ERRORGEN on Inner2: 3.75,27 40,27 40,17 3.75,17
LEDMOS1 on Top Layer: 12,31.5 13,31.5 13,29.25 12,29.25
LEDMOS1 on Top Layer: 12,53.5 13,53.5 13,51.25 12,51.25
LEDMOS1 on Top Layer: 12,64.5 12.75,64.5 12.75,62.25 12,62.25
LEDMOS1 on Top Layer: 12,42.5 13,42.5 13,40.25 12,40.25
LEDMOS1 on Top Layer: 12,59 13,59 13,56.75 12,56.75
LEDMOS1 on Top Layer: 12,37 13,37 13,34.75 12,34.75
LEDMOS1 on Top Layer: 12,48 13,48 13,45.75 12,45.75
LEDMOS1 on Bottom Layer: 11,64.5 13.75,64.5 13.75,30.5 11,30.5
LEDMOS1 on Inner1: 4.5,31.75 13.25,31.75 13.25,20.75 4.5,20.75
LEDMOS2 on Top Layer: 15,42.5 16,42.5 16,40.25 15,40.25
LEDMOS2 on Top Layer: 14.5,29.5 16,29.5 16,27.75 14.5,27.75
LEDMOS2 on Top Layer: 15,53.5 16,53.5 16,51.25 15,51.25
LEDMOS2 on Top Layer: 15,31.5 16,31.5 16,29.25 15,29.25
LEDMOS2 on Top Layer: 15,48 16,48 16,45.75 15,45.75
LEDMOS2 on Top Layer: 15,37 16,37 16,34.75 15,34.75
LEDMOS2 on Top Layer: 5.5,63.25 7,63.25 7,62.25 5.5,62.25
LEDMOS2 on Top Layer: 15,59 16,59 16,56.75 15,56.75
LEDMOS2 on Bottom Layer: 14,59 16.75,59 16.75,30.5 14,30.5
LEDMOS2 on Inner1: 3,33 15.75,33 15.75,22.5 3,22.5
LEDMOS2 on Inner1: 6.25,63.25 16,63.25 16,58.25 6.25,58.25
LEDMOS2 on Inner2: 3,33 15.75,33 15.75,22.5 3,22.5
LEDMOS2 on Inner2: 6.25,63.25 16,63.25 16,58.25 6.25,58.25
LEDMOS3 on Top Layer: 18,48 19,48 19,45.75 18,45.75
LEDMOS3 on Top Layer: 18,42.5 19,42.5 19,40.25 18,40.25
LEDMOS3 on Top Layer: 5.5,57.75 7,57.75 7,56.75 5.5,56.75
LEDMOS3 on Top Layer: 18,31.5 19,31.5 19,29.25 18,29.25
LEDMOS3 on Top Layer: 18,37 19,37 19,34.75 18,34.75
LEDMOS3 on Top Layer: 18,29.5 19,29.5 19,27.75 18,27.75
LEDMOS3 on Top Layer: 18,53.5 19,53.5 19,51.25 18,51.25
LEDMOS3 on Bottom Layer: 17,53.5 19.75,53.5 19.75,30.5 17,30.5
LEDMOS3 on Inner1: 6.25,57.75 19,57.75 19,52.75 6.25,52.75
LEDMOS3 on Inner2: 6.25,57.75 19,57.75 19,52.75 6.25,52.75
LEDMOS4 on Top Layer: 21,37 22,37 22,34.75 21,34.75
LEDMOS4 on Top Layer: 21,48 22,48 22,45.75 21,45.75
LEDMOS4 on Top Layer: 5.5,52.25 7,52.25 7,51.25 5.5,51.25
LEDMOS4 on Top Layer: 21,42.5 22,42.5 22,40.25 21,40.25
LEDMOS4 on Top Layer: 21,29.5 22.5,29.5 22.5,27.75 21,27.75
LEDMOS4 on Top Layer: 21,31.5 22,31.5 22,29.25 21,29.25
LEDMOS4 on Bottom Layer: 20,48 22.75,48 22.75,30.5 20,30.5
LEDMOS4 on Inner1: 6.25,52.25 22,52.25 22,47.25 6.25,47.25
LEDMOS4 on Inner2: 6.25,52.25 22,52.25 22,47.25 6.25,47.25
LEDMOS5 on Top Layer: 24,31.5 25,31.5 25,29.25 24,29.25
LEDMOS5 on Top Layer: 5.5,46.75 7,46.75 7,45.75 5.5,45.75
LEDMOS5 on Top Layer: 24,42.5 25,42.5 25,40.25 24,40.25
LEDMOS5 on Top Layer: 24,29.5 26,29.5 26,27.75 24,27.75
LEDMOS5 on Top Layer: 24,37 25,37 25,34.75 24,34.75
LEDMOS5 on Bottom Layer: 23,42.5 25.75,42.5 25.75,30.5 23,30.5
LEDMOS5 on Inner1: 6.25,46.75 25,46.75 25,41.75 6.25,41.75
LEDMOS5 on Inner2: 6.25,46.75 25,46.75 25,41.75 6.25,41.75
LEDMOS6 on Top Layer: 5.5,41.25 7,41.25 7,40.25 5.5,40.25
LEDMOS6 on Top Layer: 27,29.5 29.5,29.5 29.5,27.75 27,27.75
LEDMOS6 on Top Layer: 27,37 28,37 28,34.75 27,34.75
LEDMOS6 on Top Layer: 27,31.5 28,31.5 28,29.25 27,29.25
LEDMOS6 on Bottom Layer: 26,37 28.75,37 28.75,30.5 26,30.5
LEDMOS6 on Inner1: 6.25,41.25 28,41.25 28,36.25 6.25,36.25
LEDMOS6 on Inner2: 6.25,41.25 28,41.25 28,36.25 6.25,36.25
LEDMOS7 on Top Layer: 30,29.5 33,29.5 33,27.75 30,27.75
LEDMOS7 on Top Layer: 30,31.5 31,31.5 31,29.25 30,29.25
LEDMOS7 on Top Layer: 5.5,35.75 7,35.75 7,34.75 5.5,34.75
LEDMOS7 on Bottom Layer: 29,33 31.5,33 31.5,30.5 29,30.5
LEDMOS7 on Inner1: 6.25,35.75 31,35.75 31,30.75 6.25,30.75
LEDMOS7 on Inner2: 6.25,35.75 31,35.75 31,30.75 6.25,30.75
LEDMOS8 on Top Layer: 35.5,29.25 36.5,29.25 36.5,27.75 35.5,27.75
LEDMOS8 on Top Layer: 5.5,30.25 7,30.25 7,29.25 5.5,29.25
LEDMOS8 on Bottom Layer: 3.25,30.5 7,30.5 7,28 3.25,28
LEDMOS8 on Inner1: 6.5,31 36.25,31 36.25,28.5 6.5,28.5
LEDMOS8 on Inner2: 6.5,31 36.25,31 36.25,28.5 6.5,28.5
LOWBATTERROR on Top Layer: 3,5.25 4.5,5.25 4.5,1 3,1
LOWBATTERROR on Bottom Layer: 3.25,3.5 6.25,3.5 6.25,1 3.25,1
LOWBATTSIG on Top Layer: 3.25,8.75 36.25,8.75 36.25,3.5 3.25,3.5
LOWBATTSIG on Top Layer: 40,25.5 41.25,25.5 41.25,23.75 40,23.75
LOWBATTSIG on Bottom Layer: 34,24.25 40.5,24.25 40.5,3.5 34,3.5
P1 on Top Layer: 5.5,20.5 13.25,20.5 13.25,9.5 5.5,9.5
P1 on Bottom Layer: 10,15.5 12.5,15.5 12.5,13 10,13
P2 on Top Layer: 10.25,18.25 16.5,18.25 16.5,9 10.25,9
P2 on Top Layer: 15,20.75 16.5,20.75 16.5,18 15,18
P2 on Bottom Layer: 10.25,12.25 12.75,12.25 12.75,9.75 10.25,9.75
P3 on Top Layer: 18.5,20.75 20,20.75 20,18 18.5,18
P3 on Top Layer: 14.75,18.25 20,18.25 20,9 14.75,9
P3 on Bottom Layer: 14.5,12 17,12 17,9.5 14.5,9.5
P4 on Top Layer: 19.25,18.25 24.25,18.25 24.25,9 19.25,9
P4 on Top Layer: 22,20.75 23.5,20.75 23.5,18 22,18
P4 on Bottom Layer: 18.75,12 21.25,12 21.25,9.5 18.75,9.5
P5 on Top Layer: 23.75,18.25 28.75,18.25 28.75,9 23.75,9
P5 on Top Layer: 25.5,20.75 27,20.75 27,18 25.5,18
P5 on Bottom Layer: 23.25,12 25.75,12 25.75,9.5 23.25,9.5
P6 on Top Layer: 29,20.75 30.5,20.75 30.5,18 29,18
P6 on Top Layer: 28.25,18.25 33.25,18.25 33.25,9 28.25,9
P6 on Bottom Layer: 27.75,12 30.25,12 30.25,9.5 27.75,9.5
P7 on Top Layer: 32.5,20.75 34,20.75 34,18 32.5,18
P7 on Top Layer: 32.75,18.25 37.75,18.25 37.75,9 32.75,9
P7 on Bottom Layer: 30.75,12 33.25,12 33.25,9.5 30.75,9.5
P8 on Top Layer: 37.25,11 37.75,11 37.75,9 37.25,9
P8 on Top Layer: 36.25,20.5 36.75,20.5 36.75,18.5 36.25,18.5
P8 on Bottom Layer: 35.25,19 37.75,19 37.75,10.25 35.25,10.25
SWERRORSIG on Top Layer: 35,31.25 37,31.25 37,30.75 35,30.75
SWERRORSIG on Top Layer: 37.5,26.75 39.25,26.75 39.25,24.5 37.5,24.5
SWERRORSIG on Top Layer: 36,32.75 38.5,32.75 38.5,30.75 36,30.75
SWERRORSIG on Bottom Layer: 34.75,31.5 39.25,31.5 39.25,30.5 34.75,30.5
SWERRORSIG on Bottom Layer: 36.75,31.5 39.25,31.5 39.25,26.25 36.75,26.25
SWITCHERROR on Top Layer: 40,30.25 40.5,30.25 40.5,27.75 40,27.75
SWITCHERROR on Bottom Layer: 39,41.5 42,41.5 42,34.5 39,34.5
SWITCHERROR on Inner1: 39.5,41.5 42,41.5 42,27.75 39.5,27.75
USBPDSW on Top Layer: 8.75,27.75 10.75,27.75 10.75,24.25 8.75,24.25
USBPDSW on Bottom Layer: 9,28.25 11.5,28.25 11.5,25.75 9,25.75
$1N21279 on Top Layer: 7,67.5 9.25,67.5 9.25,64.5 7,64.5
$1N21357 on Top Layer: 7.25,64.75 11.75,64.75 11.75,62.25 7.25,62.25
$1N25602 on Top Layer: 13.25,64.5 14.5,64.5 14.5,62 13.25,62
$1N27046 on Top Layer: 7,62 9.25,62 9.25,59 7,59
$1N27049 on Top Layer: 13.25,59 14.75,59 14.75,56.5 13.25,56.5
$1N27054 on Top Layer: 7.25,59.25 11.75,59.25 11.75,56.75 7.25,56.75
$1N27150 on Top Layer: 16.25,59 17.75,59 17.75,56.5 16.25,56.5
$1N27157 on Top Layer: 13.25,61.25 15.75,61.25 15.75,59.5 13.25,59.5
$1N29440 on Top Layer: 7.25,53.75 11.75,53.75 11.75,51.25 7.25,51.25
$1N29442 on Top Layer: 7,56.5 9.25,56.5 9.25,53.5 7,53.5
$1N29444 on Top Layer: 13.25,55.75 15.75,55.75 15.75,54 13.25,54
$1N29448 on Top Layer: 16.25,53.5 17.75,53.5 17.75,51 16.25,51
$1N29450 on Top Layer: 13.25,53.5 14.75,53.5 14.75,51 13.25,51
$1N29549 on Top Layer: 19.25,53.5 20.75,53.5 20.75,51 19.25,51
$1N29569 on Top Layer: 16.25,55.75 18.75,55.75 18.75,54 16.25,54
$1N30119 on Top Layer: 16.25,50.25 18.75,50.25 18.75,48.5 16.25,48.5
$1N30127 on Top Layer: 16.25,48 17.75,48 17.75,45.5 16.25,45.5
$1N30129 on Top Layer: 19.25,48 20.75,48 20.75,45.5 19.25,45.5
$1N30131 on Top Layer: 13.25,48 14.75,48 14.75,45.5 13.25,45.5
$1N30133 on Top Layer: 13.25,50.25 15.75,50.25 15.75,48.5 13.25,48.5
$1N30135 on Top Layer: 7.25,48.25 11.75,48.25 11.75,45.75 7.25,45.75
$1N30137 on Top Layer: 7,51 9.25,51 9.25,48 7,48
$1N30234 on Top Layer: 22.25,48 23.75,48 23.75,45.5 22.25,45.5
$1N30241 on Top Layer: 19.25,50.25 21.75,50.25 21.75,48.5 19.25,48.5
$1N30920 on Top Layer: 19.25,42.5 20.75,42.5 20.75,40 19.25,40
$1N30922 on Top Layer: 16.25,44.75 18.75,44.75 18.75,43 16.25,43
$1N30924 on Top Layer: 13.25,42.5 14.75,42.5 14.75,40 13.25,40
$1N30926 on Top Layer: 13.25,44.75 15.75,44.75 15.75,43 13.25,43
$1N30928 on Top Layer: 16.25,42.5 17.75,42.5 17.75,40 16.25,40
$1N30938 on Top Layer: 7,45.5 9.25,45.5 9.25,42.5 7,42.5
$1N30939 on Top Layer: 7.25,42.75 11.75,42.75 11.75,40.25 7.25,40.25
$1N30943 on Top Layer: 19.25,44.75 21.75,44.75 21.75,43 19.25,43
$1N30949 on Top Layer: 22.25,42.5 23.75,42.5 23.75,40 22.25,40
$1N31050 on Top Layer: 25.25,42.5 26.75,42.5 26.75,40 25.25,40
$1N31069 on Top Layer: 22.25,44.75 24.75,44.75 24.75,43 22.25,43
$1N31779 on Top Layer: 13.25,39.25 15.75,39.25 15.75,37.5 13.25,37.5
$1N31781 on Top Layer: 13.25,37 14.75,37 14.75,34.5 13.25,34.5
$1N31784 on Top Layer: 7.25,37.25 11.75,37.25 11.75,34.75 7.25,34.75
$1N31785 on Top Layer: 7,40 9.25,40 9.25,37 7,37
$1N31791 on Top Layer: 22.25,39.25 24.75,39.25 24.75,37.5 22.25,37.5
$1N31793 on Top Layer: 22.25,37 23.75,37 23.75,34.5 22.25,34.5
$1N31795 on Top Layer: 25.25,37 26.75,37 26.75,34.5 25.25,34.5
$1N31799 on Top Layer: 16.25,37 17.75,37 17.75,34.5 16.25,34.5
$1N31801 on Top Layer: 16.25,39.25 18.75,39.25 18.75,37.5 16.25,37.5
$1N31803 on Top Layer: 19.25,37 20.75,37 20.75,34.5 19.25,34.5
$1N31809 on Top Layer: 19.25,39.25 21.75,39.25 21.75,37.5 19.25,37.5
$1N31922 on Top Layer: 28.25,37 29.75,37 29.75,34.5 28.25,34.5
$1N31941 on Top Layer: 25.25,39.25 27.75,39.25 27.75,37.5 25.25,37.5
$1N39505 on Top Layer: 25.25,33.75 27.75,33.75 27.75,32 25.25,32
$1N39506 on Top Layer: 19.25,31.5 20.75,31.5 20.75,29.25 19.25,29.25
$1N39508 on Top Layer: 19.25,33.75 21.75,33.75 21.75,32 19.25,32
$1N39509 on Top Layer: 16.25,31.5 17.75,31.5 17.75,29.25 16.25,29.25
$1N39511 on Top Layer: 16.25,33.75 18.75,33.75 18.75,32 16.25,32
$1N39513 on Top Layer: 22.25,31.5 23.75,31.5 23.75,29.25 22.25,29.25
$1N39516 on Top Layer: 13.25,31.5 14.75,31.5 14.75,29.25 13.25,29.25
$1N39518 on Top Layer: 7,34.5 9.25,34.5 9.25,31.5 7,31.5
$1N39519 on Top Layer: 22.25,33.75 24.75,33.75 24.75,32 22.25,32
$1N39520 on Top Layer: 25.25,31.5 26.75,31.5 26.75,29.25 25.25,29.25
$1N39523 on Top Layer: 28.25,31.5 29.75,31.5 29.75,29.25 28.25,29.25
$1N39525 on Top Layer: 13.25,33.75 15.75,33.75 15.75,32 13.25,32
$1N39527 on Top Layer: 7.25,31.75 11.75,31.75 11.75,29.25 7.25,29.25
$1N39630 on Top Layer: 31.25,31.5 32.75,31.5 32.75,29.25 31.25,29.25
$1N53925 on Top Layer: 3.25,15 6,15 6,13.25 3.25,13.25
$1N54024 on Top Layer: 4.5,13 6.5,13 6.5,8.25 4.5,8.25
$1N61018 on Top Layer: 7.75,14.25 10.5,14.25 10.5,12.5 7.75,12.5
$1N61120 on Top Layer: 10,8.5 11.25,8.5 11.25,4.5 10,4.5
$1N64738 on Top Layer: 14.5,8.5 15.75,8.5 15.75,4.5 14.5,4.5
$1N64740 on Top Layer: 12.25,14.25 15,14.25 15,12.5 12.25,12.5
$1N65275 on Top Layer: 19,8.5 20.25,8.5 20.25,4.5 19,4.5
$1N65277 on Top Layer: 16.75,14.25 19.5,14.25 19.5,12.5 16.75,12.5
$1N65545 on Top Layer: 23.5,8.5 24.75,8.5 24.75,4.5 23.5,4.5
$1N65547 on Top Layer: 21.25,14.25 24,14.25 24,12.5 21.25,12.5
$1N65815 on Top Layer: 28,8.5 29.25,8.5 29.25,4.5 28,4.5
$1N65817 on Top Layer: 25.75,14.25 28.5,14.25 28.5,12.5 25.75,12.5
$1N66085 on Top Layer: 32.5,8.5 33.75,8.5 33.75,4.5 32.5,4.5
$1N66087 on Top Layer: 30.25,14.25 33,14.25 33,12.5 30.25,12.5
$1N66355 on Top Layer: 37,8.5 38.25,8.5 38.25,4.5 37,4.5
$1N66357 on Top Layer: 34.75,14.25 37.5,14.25 37.5,12.5 34.75,12.5
$1N84396 on Top Layer: 9.75,49.75 12.5,49.75 12.5,48.25 9.75,48.25
$1N84443 on Top Layer: 3,48.5 4,48.5 4,45.75 3,45.75
$1N84445 on Top Layer: 4,51 6.5,51 6.5,49 4,49
$1N84660 on Top Layer: 9.75,44.25 12.5,44.25 12.5,42.75 9.75,42.75
$1N84707 on Top Layer: 3,43 4,43 4,40.25 3,40.25
$1N84709 on Top Layer: 4,45.5 6.5,45.5 6.5,43.5 4,43.5
$1N84795 on Top Layer: 9.75,38.75 12.5,38.75 12.5,37.25 9.75,37.25
$1N84968 on Top Layer: 3,37.5 4,37.5 4,34.75 3,34.75
$1N84970 on Top Layer: 4,40 6.5,40 6.5,38 4,38
$1N85146 on Top Layer: 9.75,55.25 12.5,55.25 12.5,53.75 9.75,53.75
$1N85193 on Top Layer: 3,54 4,54 4,51.25 3,51.25
$1N85195 on Top Layer: 4,56.5 6.5,56.5 6.5,54.5 4,54.5
$1N85239 on Top Layer: 9.75,60.75 12.5,60.75 12.5,59.25 9.75,59.25
$1N85373 on Top Layer: 3,65 4,65 4,62.25 3,62.25
$1N85375 on Top Layer: 4,67.5 6.5,67.5 6.5,65.5 4,65.5
$1N85419 on Top Layer: 9.75,66.25 12.5,66.25 12.5,64.75 9.75,64.75
$1N85469 on Top Layer: 3,32 4,32 4,29.25 3,29.25
$1N85471 on Top Layer: 4,34.5 6.5,34.5 6.5,32.5 4,32.5
$1N85819 on Top Layer: 3,59.5 4,59.5 4,56.75 3,56.75
$1N85821 on Top Layer: 4,62 6.5,62 6.5,60 4,60
$1N85824 on Top Layer: 9.75,33.25 12.5,33.25 12.5,31.75 9.75,31.75
$1N85829 on Top Layer: 28.25,33.75 30.75,33.75 30.75,32 28.25,32
$1N86427 on Top Layer: 8.25,12 9.75,12 9.75,7.5 8.25,7.5
$1N86477 on Top Layer: 12.75,12 14.25,12 14.25,7.5 12.75,7.5
$1N86527 on Top Layer: 17.25,12 18.75,12 18.75,7.5 17.25,7.5
$1N86577 on Top Layer: 21.75,12 23.25,12 23.25,7.5 21.75,7.5
$1N86627 on Top Layer: 26.25,12 27.75,12 27.75,7.5 26.25,7.5
$1N86677 on Top Layer: 30.75,12 32.25,12 32.25,7.5 30.75,7.5
$1N86727 on Top Layer: 35.25,12 36.75,12 36.75,7.5 35.25,7.5
$1N86766 on Top Layer: 3.25,13.5 4.5,13.5 4.5,9.75 3.25,9.75
$1N86805 on Top Layer: 7.75,12.75 9,12.75 9,9 7.75,9
$1N86844 on Top Layer: 12.25,12.75 13.5,12.75 13.5,9 12.25,9
$1N86883 on Top Layer: 16.75,12.75 18,12.75 18,9 16.75,9
$1N86922 on Top Layer: 21.25,12.75 22.5,12.75 22.5,9 21.25,9
$1N86961 on Top Layer: 25.75,12.75 27,12.75 27,9 25.75,9
$1N87000 on Top Layer: 30.25,12.75 31.5,12.75 31.5,9 30.25,9
$1N87039 on Top Layer: 34.75,12.75 36,12.75 36,9 34.75,9
$2N3494 on Top Layer: 20.25,57.5 35.75,57.5 35.75,55.75 20.25,55.75
$2N3494 on Top Layer: 29.5,42.5 35.75,42.5 35.75,40.75 29.5,40.75
$2N3494 on Top Layer: 14.5,67.5 35.75,67.5 35.75,65.75 14.5,65.75
$2N3494 on Top Layer: 17.5,62.5 35.75,62.5 35.75,60.75 17.5,60.75
$2N3494 on Top Layer: 26.5,47.5 35.75,47.5 35.75,45.75 26.5,45.75
$2N3494 on Top Layer: 23.5,52.5 35.75,52.5 35.75,50.75 23.5,50.75
$2N3494 on Top Layer: 33,37.5 35.75,37.5 35.75,34.25 33,34.25
$2N3494 on Bottom Layer: 14,67.5 33.75,67.5 33.75,35.75 14,35.75
$2N3495 on Top Layer: 30.25,47.5 38.75,47.5 38.75,45.75 30.25,45.75
$2N3497 on Top Layer: 39.5,50.25 40.5,50.25 40.5,48 39.5,48
$2N3499 on Top Layer: 39.5,45.25 40.5,45.25 40.5,43 39.5,43
$2N3506 on Top Layer: 33.25,33.75 35.25,33.75 35.25,31.5 33.25,31.5
$2N3510 on Top Layer: 33.25,42.5 38.75,42.5 38.75,40.75 33.25,40.75
$2N3513 on Top Layer: 39.5,35.25 40.5,35.25 40.5,33 39.5,33
$2N3515 on Top Layer: 39.5,40.25 40.5,40.25 40.5,38 39.5,38
$2N3520 on Top Layer: 36.25,37.25 38.75,37.25 38.75,35.75 36.25,35.75
$2N3526 on Top Layer: 24.25,57.5 38.75,57.5 38.75,55.75 24.25,55.75
$2N3529 on Top Layer: 21,62.5 38.75,62.5 38.75,60.75 21,60.75
$2N3538 on Top Layer: 18.25,67.5 38.75,67.5 38.75,65.75 18.25,65.75
$2N3547 on Top Layer: 39.5,60.25 40.5,60.25 40.5,58 39.5,58
$2N3551 on Top Layer: 39.5,65.25 40.5,65.25 40.5,63 39.5,63
$2N3557 on Top Layer: 27.25,52.5 38.75,52.5 38.75,50.75 27.25,50.75
$2N3569 on Top Layer: 39.5,55.25 40.5,55.25 40.5,53 39.5,53
$2N10447 on Top Layer: 23,26.25 24.25,26.25 24.25,23 23,23
$2N10452 on Top Layer: 19.5,26.25 20.75,26.25 20.75,23 19.5,23
$2N10457 on Top Layer: 16,26.25 17.25,26.25 17.25,23 16,23
$2N10464 on Top Layer: 12.5,26.25 13.75,26.25 13.75,23 12.5,23
$2N10475 on Top Layer: 30,26.25 31.25,26.25 31.25,23 30,23
$2N10490 on Top Layer: 26.5,26.25 27.75,26.25 27.75,23 26.5,23
$2N10501 on Top Layer: 33.5,26.25 34.75,26.25 34.75,23 33.5,23
$2N14263 on Top Layer: 37.5,23.25 41.25,23.25 41.25,20 37.5,20
$2N18109 on Top Layer: 6.75,28.75 8.75,28.75 8.75,27 6.75,27
$2N29880 on Top Layer: 36.5,35.25 37.5,35.25 37.5,33 36.5,33
$2N30008 on Top Layer: 33.5,40.25 34.5,40.25 34.5,38 33.5,38
$2N30053 on Top Layer: 36.5,40.25 37.5,40.25 37.5,38 36.5,38
$2N30097 on Top Layer: 36.5,45.25 37.5,45.25 37.5,43 36.5,43
$2N30141 on Top Layer: 33.5,45.25 34.5,45.25 34.5,43 33.5,43
$2N30186 on Top Layer: 30.5,45.25 31.5,45.25 31.5,43 30.5,43
$2N30316 on Top Layer: 27.5,50.25 28.5,50.25 28.5,48 27.5,48
$2N30360 on Top Layer: 30.5,50.25 31.5,50.25 31.5,48 30.5,48
$2N30405 on Top Layer: 33.5,50.25 34.5,50.25 34.5,48 33.5,48
$2N30450 on Top Layer: 36.5,50.25 37.5,50.25 37.5,48 36.5,48
$2N30537 on Top Layer: 24.5,55.25 25.5,55.25 25.5,53 24.5,53
$2N30581 on Top Layer: 27.5,55.25 28.5,55.25 28.5,53 27.5,53
$2N30626 on Top Layer: 30.5,55.25 31.5,55.25 31.5,53 30.5,53
$2N30671 on Top Layer: 33.5,55.25 34.5,55.25 34.5,53 33.5,53
$2N30716 on Top Layer: 36.5,55.25 37.5,55.25 37.5,53 36.5,53
$2N30803 on Top Layer: 36.5,60.25 37.5,60.25 37.5,58 36.5,58
$2N30847 on Top Layer: 33.5,60.25 34.5,60.25 34.5,58 33.5,58
$2N30892 on Top Layer: 30.5,60.25 31.5,60.25 31.5,58 30.5,58
$2N30937 on Top Layer: 27.5,60.25 28.5,60.25 28.5,58 27.5,58
$2N30982 on Top Layer: 24.5,60.25 25.5,60.25 25.5,58 24.5,58
$2N31114 on Top Layer: 18.5,65.25 19.5,65.25 19.5,63 18.5,63
$2N31158 on Top Layer: 21.5,65.25 22.5,65.25 22.5,63 21.5,63
$2N31203 on Top Layer: 24.5,65.25 25.5,65.25 25.5,63 24.5,63
$2N31248 on Top Layer: 27.5,65.25 28.5,65.25 28.5,63 27.5,63
$2N31293 on Top Layer: 30.5,65.25 31.5,65.25 31.5,63 30.5,63
$2N31338 on Top Layer: 33.5,65.25 34.5,65.25 34.5,63 33.5,63
$2N31383 on Top Layer: 36.5,65.25 37.5,65.25 37.5,63 36.5,63
$2N31428 on Top Layer: 21.5,60.25 22.5,60.25 22.5,58 21.5,58
$2N31472 on Top Layer: 3.25,28.5 6,28.5 6,27.5 3.25,27.5
$2N31519 on Top Layer: 3.25,25.5 6,25.5 6,24 3.25,24
$2N31521 on Top Layer: 4.75,26.75 8,26.75 8,23.5 4.75,23.5
$2N31571 on Top Layer: 14.25,23.75 15.25,23.75 15.25,21.5 14.25,21.5
$2N31621 on Top Layer: 17.75,23.75 18.75,23.75 18.75,21.5 17.75,21.5
$2N31671 on Top Layer: 21.25,23.75 22.25,23.75 22.25,21.5 21.25,21.5
$2N31721 on Top Layer: 24.75,23.75 25.75,23.75 25.75,21.5 24.75,21.5
$2N31771 on Top Layer: 28.25,23.75 29.25,23.75 29.25,21.5 28.25,21.5
$2N31821 on Top Layer: 31.75,23.75 32.75,23.75 32.75,21.5 31.75,21.5
$2N31871 on Top Layer: 35.25,23.75 36.25,23.75 36.25,21.5 35.25,21.5
$2N31913 on Top Layer: 34,21 35.75,21 35.75,18 34,18
$2N31992 on Top Layer: 27,20.75 28.75,20.75 28.75,18 27,18
$2N32034 on Top Layer: 23.5,20.75 25.25,20.75 25.25,18 23.5,18
$2N32039 on Top Layer: 30.5,20.75 32.25,20.75 32.25,18 30.5,18
$2N32081 on Top Layer: 20,20.75 21.75,20.75 21.75,18 20,18
$2N32165 on Top Layer: 13,20.75 14.75,20.75 14.75,18 13,18
$2N39567 on Top Layer: 16.5,20.75 18.25,20.75 18.25,18 16.5,18

Small or netless copper shapes (teardrops, artwork), in the pictures only: 17 on Top Layer

## Text on the board
Bottom Silkscreen Layer: EB | L8 | EC | GND | P1 | P2 | L1 | E0 | L2 | P3 | +5V | L3 | C8 | P4 | L4 | C7 | L5 | C6 | P5 | L6 | C5 | P6 | L7 | C4 | P7 | C3 | C2 | P8 | C1 | USBSW | ES
